# Altium schematic sheet Output.SchDoc
size A4
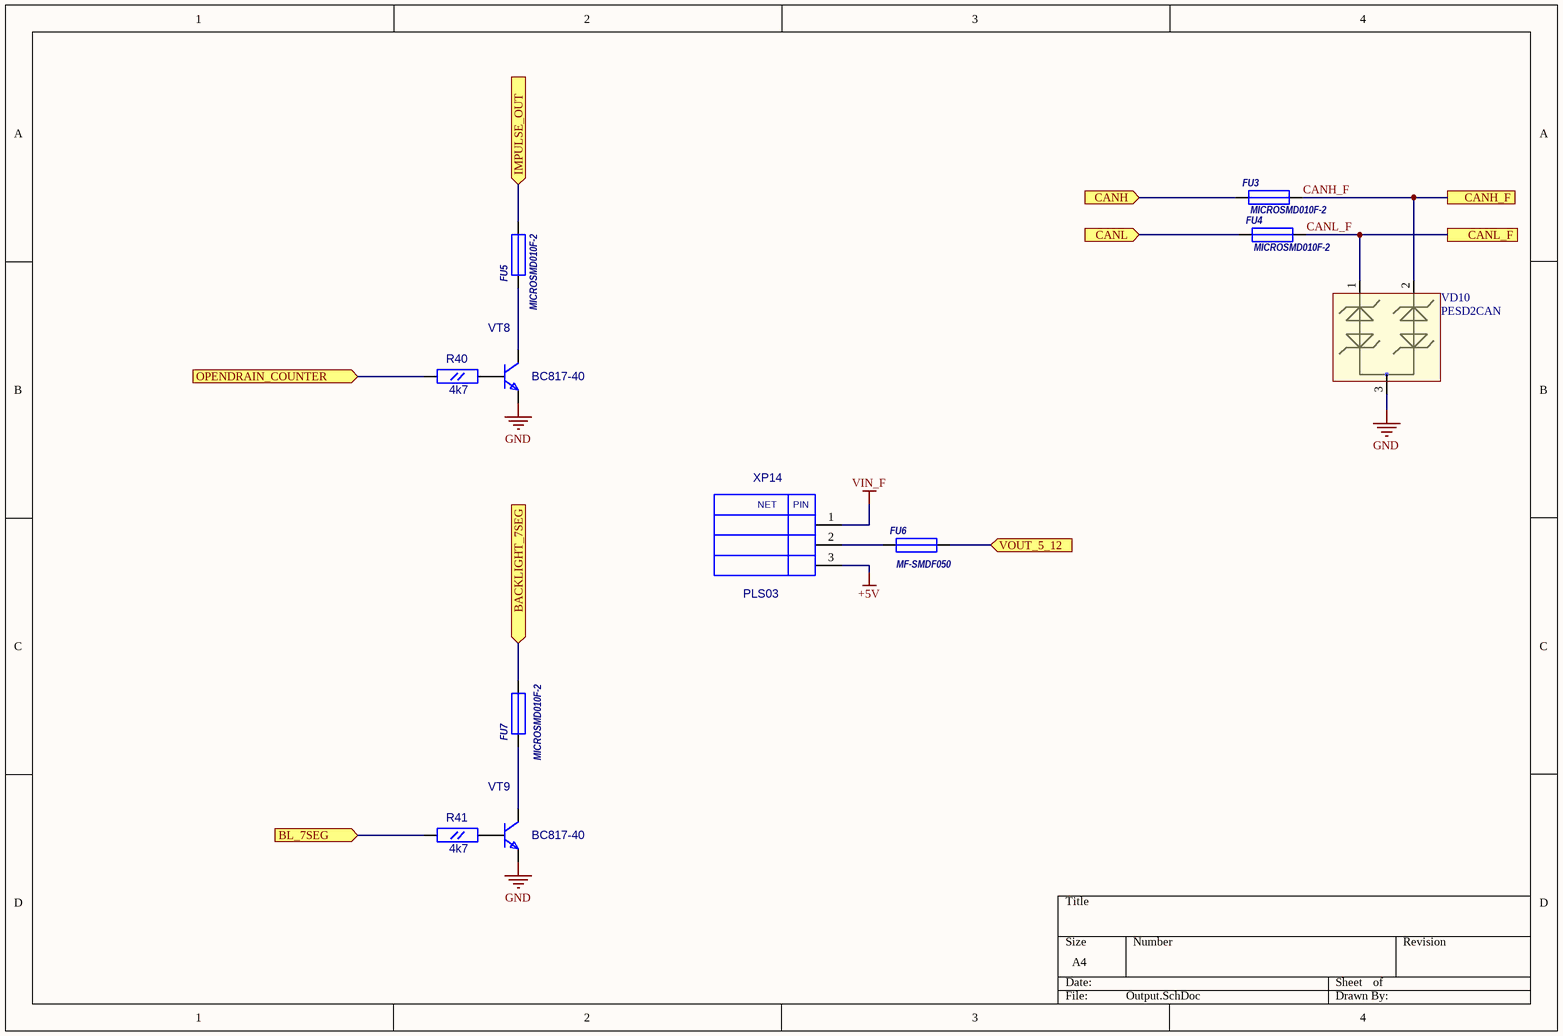
[diagram p0: Output.SchDoc]

## Parts
FU3  MICROSMD010F-2  [RC1210]
FU4  MICROSMD010F-2  [RC1210]
FU5  MICROSMD010F-2  [RC1210]
FU6  MF-SMDF050  [MF-SMDF]
FU7  MICROSMD010F-2  [RC1210]
R40  4k7  [RC0603]
R41  4k7  [RC0603]
VD10  PESD2CAN  [SOT-23(123)]
VT8  BC817-40  [SOT-23(123)]
VT9  BC817-40  [SOT-23(123)]
XP14  PLS03  [PLS-03]

## Ports
BACKLIGHT_7SEG (in), BL_7SEG (in), CANH (in), CANH_F, CANL (in), CANL_F, IMPULSE_OUT (in), OPENDRAIN_COUNTER (in), VOUT_5_12 (in)

## Nets
+5V: XP14.3
GND: VD10.3 VT8.2(E) VT9.2(E)
VIN_F: XP14.1
BACKLIGHT_7SEG: FU7.2 ; port BACKLIGHT_7SEG
BL_7SEG: R41.1(A) ; port BL_7SEG
CANH: FU3.1 ; port CANH
CANH_F: FU3.2 VD10.2 ; port CANH_F
CANL: FU4.1 ; port CANL
CANL_F: FU4.2 VD10.1 ; port CANL_F
IMPULSE_OUT: FU5.2 ; port IMPULSE_OUT
OPENDRAIN_COUNTER: R40.1(A) ; port OPENDRAIN_COUNTER
VOUT_5_12: FU6.2 ; port VOUT_5_12
NetFU5_1: FU5.1 VT8.3(C)
NetFU6_1: FU6.1 XP14.2
NetFU7_1: FU7.1 VT9.3(C)
NetR40_2: R40.2(B) VT8.1(B)
NetR41_2: R41.2(B) VT9.1(B)

## Notes on the sheet
- (in symbol PLS03) NET; PIN

## Library data of the parts
FU3-FU5 FU7 = MICROSMD
  FU3 FU4: Value: MICROSMD010F-2
  FU5 FU7: Value: *
FU6 = MF-SMDF: Value: MF-SMDF050
R40 R41 = RC0603: Value: 4k7
VD10 = PESD2CAN: TVS for CAN
VT8 VT9 = BC846BLT1: NPN 500ma transistor; ComponentField7: Published 29-Sep-2000; OriginalName: BC846BLT1; Value: BC817-40
XP14 = PLS03: Value: *